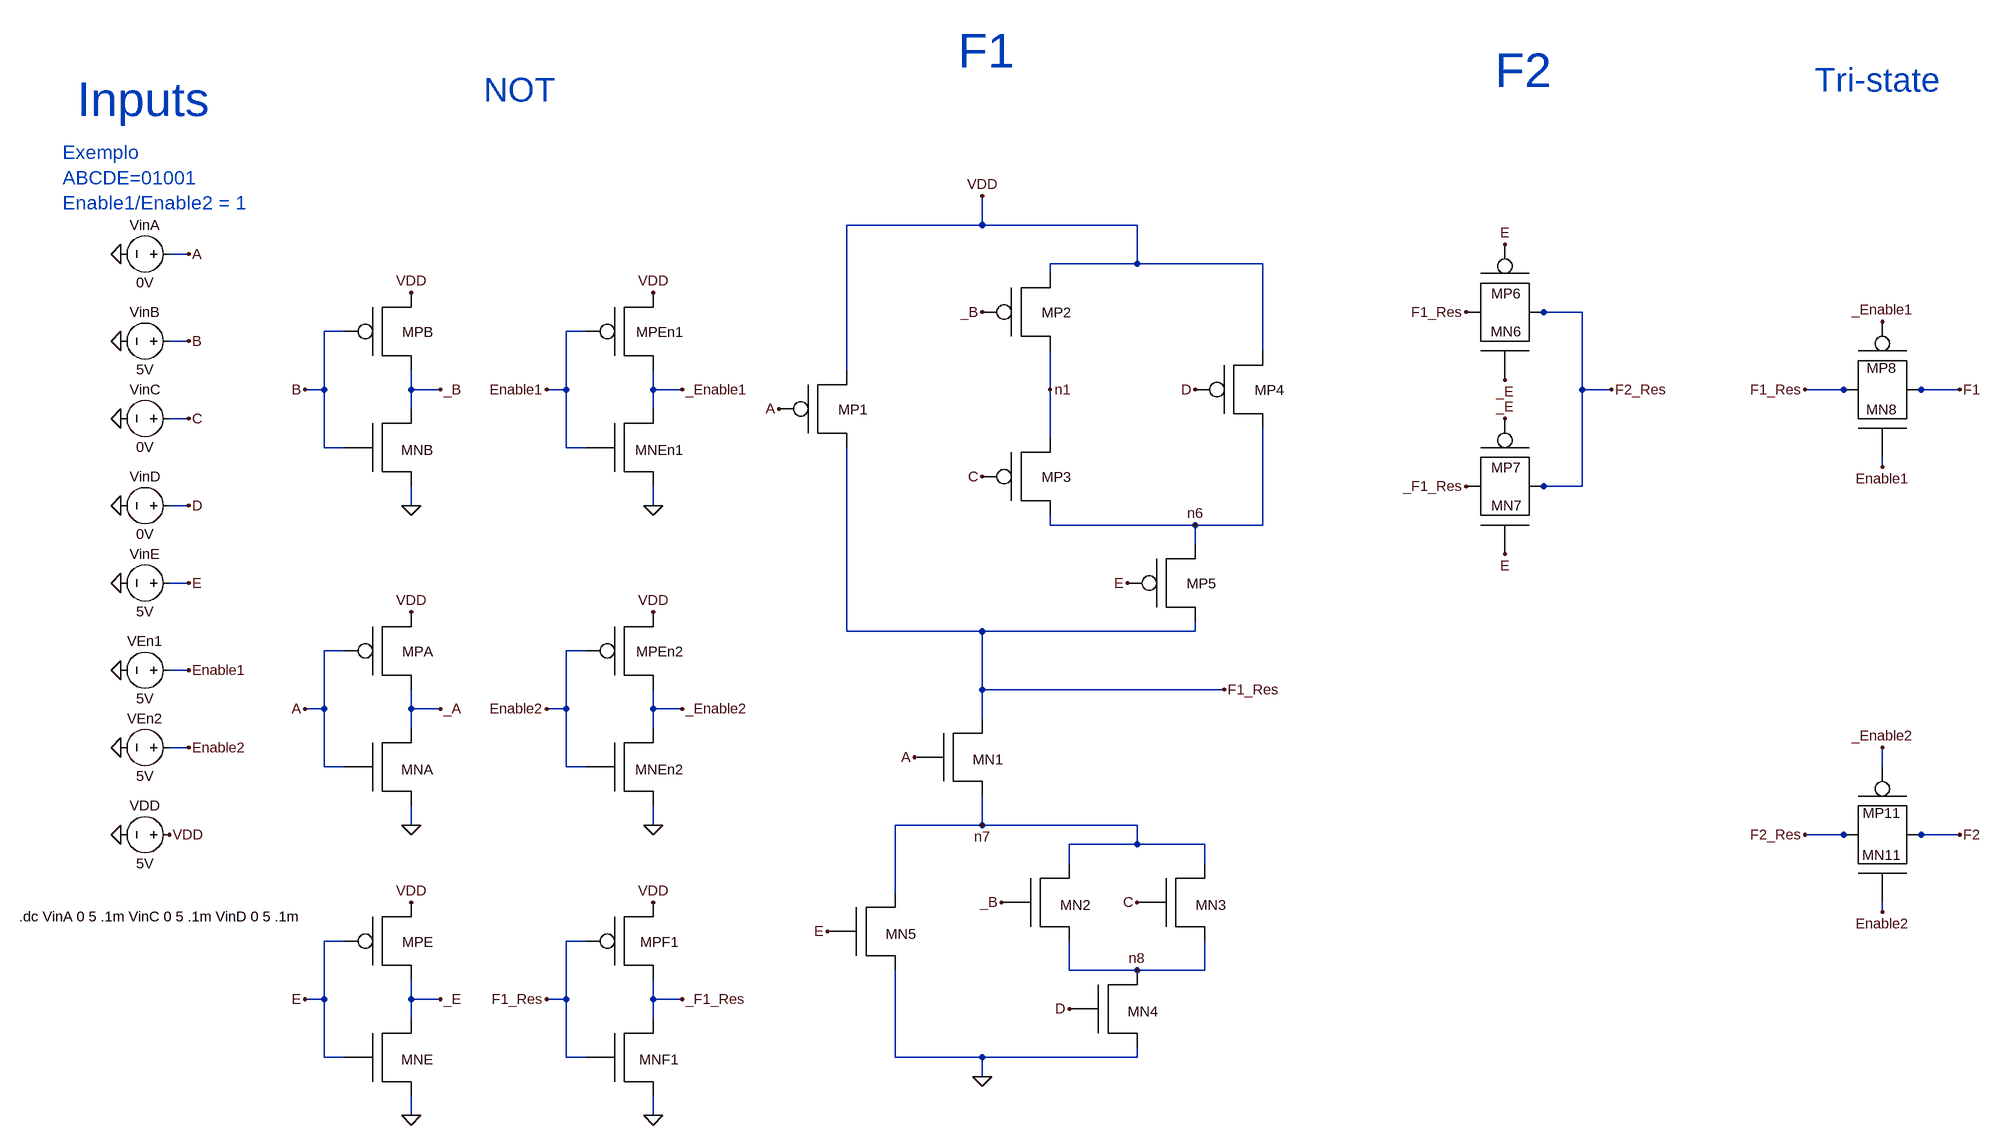
[diagram p0: schematic Tensao_VTC.asc]
Tensao_VTC.asc, the LTspice schematic file:
Version 4
SHEET 1 3140 2108
WIRE -32 -560 -32 -608
WIRE -32 -560 -256 -560
WIRE 224 -560 -32 -560
WIRE -1344 -512 -1376 -512
WIRE 224 -496 224 -560
WIRE 224 -496 80 -496
WIRE 432 -496 224 -496
WIRE 80 -480 80 -496
WIRE 896 -416 880 -416
WIRE 960 -416 896 -416
WIRE -1088 -384 -1120 -384
WIRE -688 -384 -720 -384
WIRE -1344 -368 -1376 -368
WIRE 432 -352 432 -496
WIRE -256 -320 -256 -560
WIRE -1120 -288 -1120 -384
WIRE -1120 -288 -1152 -288
WIRE -976 -288 -976 -320
WIRE -928 -288 -976 -288
WIRE -720 -288 -720 -384
WIRE -720 -288 -752 -288
WIRE -576 -288 -576 -320
WIRE -528 -288 -576 -288
WIRE 80 -288 80 -352
WIRE 960 -288 960 -416
WIRE 1008 -288 960 -288
WIRE 1392 -288 1328 -288
WIRE 1584 -288 1520 -288
WIRE -976 -256 -976 -288
WIRE -576 -256 -576 -288
WIRE -1344 -240 -1376 -240
WIRE 80 -208 80 -288
WIRE -1120 -192 -1120 -288
WIRE -1088 -192 -1120 -192
WIRE -720 -192 -720 -288
WIRE -688 -192 -720 -192
WIRE 1456 -160 1456 -176
WIRE 896 -128 880 -128
WIRE 960 -128 960 -288
WIRE 960 -128 896 -128
WIRE -1344 -96 -1376 -96
WIRE -976 -96 -976 -128
WIRE -576 -96 -576 -128
WIRE 80 -64 80 -80
WIRE 320 -64 80 -64
WIRE 432 -64 432 -224
WIRE 432 -64 320 -64
WIRE 320 -32 320 -64
WIRE -1344 32 -1376 32
WIRE -256 112 -256 -192
WIRE -32 112 -256 112
WIRE 320 112 320 96
WIRE 320 112 -32 112
WIRE -1088 144 -1120 144
WIRE -688 144 -720 144
WIRE -1344 176 -1376 176
WIRE -32 208 -32 112
WIRE 368 208 -32 208
WIRE -1120 240 -1120 144
WIRE -1120 240 -1152 240
WIRE -976 240 -976 208
WIRE -928 240 -976 240
WIRE -720 240 -720 144
WIRE -720 240 -752 240
WIRE -576 240 -576 208
WIRE -528 240 -576 240
WIRE -32 256 -32 208
WIRE -976 272 -976 240
WIRE -576 272 -576 240
WIRE -1344 304 -1376 304
WIRE -1120 336 -1120 240
WIRE -1088 336 -1120 336
WIRE -720 336 -720 240
WIRE -688 336 -720 336
WIRE 1456 336 1456 304
WIRE -976 432 -976 400
WIRE -576 432 -576 400
WIRE -32 432 -32 384
WIRE -32 432 -176 432
WIRE 224 432 -32 432
WIRE 1392 448 1328 448
WIRE 1584 448 1520 448
WIRE 224 464 224 432
WIRE 224 464 112 464
WIRE 336 464 224 464
WIRE 112 496 112 464
WIRE 336 496 336 464
WIRE -176 544 -176 432
WIRE 1456 576 1456 560
WIRE -1088 624 -1120 624
WIRE -688 624 -720 624
WIRE 112 672 112 624
WIRE 224 672 112 672
WIRE 336 672 336 624
WIRE 336 672 224 672
WIRE -1120 720 -1120 624
WIRE -1120 720 -1152 720
WIRE -976 720 -976 688
WIRE -928 720 -976 720
WIRE -720 720 -720 624
WIRE -720 720 -752 720
WIRE -576 720 -576 688
WIRE -528 720 -576 720
WIRE -976 752 -976 720
WIRE -576 752 -576 720
WIRE -1120 816 -1120 720
WIRE -1088 816 -1120 816
WIRE -720 816 -720 720
WIRE -688 816 -720 816
WIRE -176 816 -176 672
WIRE -32 816 -176 816
WIRE 224 816 224 800
WIRE 224 816 -32 816
WIRE -32 848 -32 816
WIRE -976 912 -976 880
WIRE -576 912 -576 880
FLAG -368 -256 A
FLAG -32 -144 C
FLAG 320 -288 D
FLAG 208 32 E
FLAG -144 320 A
FLAG -288 608 E
FLAG 224 560 C
FLAG 112 736 D
FLAG -32 848 0
FLAG 368 208 F1_Res
FLAG -32 -608 VDD
FLAG -32 -416 _B
FLAG 0 560 _B
FLAG -1152 -288 B
FLAG -928 -288 _B
FLAG -976 -96 0
FLAG -928 240 _A
FLAG -976 432 0
FLAG -1456 448 0
FLAG -1376 448 VDD
FLAG -976 -448 VDD
FLAG -976 80 VDD
FLAG -1344 -512 A
FLAG 1328 -288 F1_Res
FLAG 1584 -288 F1
FLAG 1456 576 Enable2
FLAG 1328 448 F2_Res
FLAG 1584 448 F2
FLAG 1456 304 _Enable2
FLAG -752 -288 Enable1
FLAG -528 -288 _Enable1
FLAG -576 -96 0
FLAG -752 240 Enable2
FLAG -528 240 _Enable2
FLAG -576 432 0
FLAG -576 -448 VDD
FLAG -576 80 VDD
FLAG 1456 -160 Enable1
FLAG 1456 -400 _Enable1
FLAG 80 -288 n1
FLAG -1456 -512 0
FLAG -1344 -368 B
FLAG -1456 -368 0
FLAG -1344 -240 C
FLAG -1456 -240 0
FLAG -1344 -96 D
FLAG -1456 -96 0
FLAG -1344 32 E
FLAG -1456 32 0
FLAG -1344 176 Enable1
FLAG -1456 176 0
FLAG -1344 304 Enable2
FLAG -1456 304 0
FLAG -1152 240 A
FLAG 320 -64 n6
FLAG -32 432 n7
FLAG 224 672 n8
FLAG 1008 -288 F2_Res
FLAG 768 -416 F1_Res
FLAG 768 -128 _F1_Res
FLAG 832 -528 E
FLAG 832 -304 _E
FLAG 832 -240 _E
FLAG 832 -16 E
FLAG -1152 720 E
FLAG -928 720 _E
FLAG -976 912 0
FLAG -976 560 VDD
FLAG -752 720 F1_Res
FLAG -528 720 _F1_Res
FLAG -576 912 0
FLAG -576 560 VDD
SYMBOL PMOSX -288 -272 R0
SYMATTR InstName MP1
SYMBOL PMOSX 48 -432 R0
SYMATTR InstName MP2
SYMBOL PMOSX 48 -160 R0
SYMATTR InstName MP3
SYMBOL PMOSX 400 -304 R0
SYMATTR InstName MP4
SYMBOL PMOSX 288 16 R0
SYMATTR InstName MP5
SYMBOL NMOSX -64 304 R0
SYMATTR InstName MN1
SYMBOL NMOSX 80 544 R0
SYMATTR InstName MN2
SYMBOL NMOSX 304 544 R0
SYMATTR InstName MN3
SYMBOL NMOSX 192 720 R0
SYMATTR InstName MN4
SYMBOL NMOSX -208 592 R0
SYMATTR InstName MN5
SYMBOL NMOSX -1008 -208 R0
SYMATTR InstName MNB
SYMBOL PMOSX -1008 -400 R0
SYMATTR InstName MPB
SYMBOL NMOSX -1008 320 R0
SYMATTR InstName MNA
SYMBOL PMOSX -1008 128 R0
SYMATTR InstName MPA
SYMBOL voltage -1360 448 R90
WINDOW 0 -32 56 VBottom 2
WINDOW 3 32 56 VTop 2
WINDOW 123 0 0 Left 0
WINDOW 39 0 0 Left 0
SYMATTR InstName VDD
SYMATTR Value 5V
SYMBOL NMOSX 1440 -256 R270
WINDOW 0 52 15 VTop 2
SYMATTR InstName MP8
SYMBOL PMOSX 1472 -320 R90
WINDOW 0 50 17 VTop 2
SYMATTR InstName MN8
SYMBOL NMOSX 1440 480 R270
WINDOW 0 52 15 VTop 2
SYMATTR InstName MP11
SYMBOL PMOSX 1472 416 R90
WINDOW 0 50 17 VTop 2
SYMATTR InstName MN11
SYMBOL NMOSX -608 -208 R0
SYMATTR InstName MNEn1
SYMBOL PMOSX -608 -400 R0
SYMATTR InstName MPEn1
SYMBOL NMOSX -608 320 R0
SYMATTR InstName MNEn2
SYMBOL PMOSX -608 128 R0
SYMATTR InstName MPEn2
SYMBOL voltage -1360 -512 R90
WINDOW 0 -32 56 VBottom 2
WINDOW 3 32 56 VTop 2
WINDOW 123 0 0 Left 0
WINDOW 39 0 0 Left 0
SYMATTR InstName VinA
SYMATTR Value 0V
SYMBOL voltage -1360 -368 R90
WINDOW 0 -32 56 VBottom 2
WINDOW 3 32 56 VTop 2
WINDOW 123 0 0 Left 0
WINDOW 39 0 0 Left 0
SYMATTR InstName VinB
SYMATTR Value 5V
SYMBOL voltage -1360 -240 R90
WINDOW 0 -32 56 VBottom 2
WINDOW 3 32 56 VTop 2
WINDOW 123 0 0 Left 0
WINDOW 39 0 0 Left 0
SYMATTR InstName VinC
SYMATTR Value 0V
SYMBOL voltage -1360 -96 R90
WINDOW 0 -32 56 VBottom 2
WINDOW 3 32 56 VTop 2
WINDOW 123 0 0 Left 0
WINDOW 39 0 0 Left 0
SYMATTR InstName VinD
SYMATTR Value 0V
SYMBOL voltage -1360 32 R90
WINDOW 0 -32 56 VBottom 2
WINDOW 3 32 56 VTop 2
WINDOW 123 0 0 Left 0
WINDOW 39 0 0 Left 0
SYMATTR InstName VinE
SYMATTR Value 5V
SYMBOL voltage -1360 176 R90
WINDOW 0 -32 56 VBottom 2
WINDOW 3 32 56 VTop 2
WINDOW 123 0 0 Left 0
WINDOW 39 0 0 Left 0
SYMATTR InstName VEn1
SYMATTR Value 5V
SYMBOL voltage -1360 304 R90
WINDOW 0 -32 56 VBottom 2
WINDOW 3 32 56 VTop 2
WINDOW 123 0 0 Left 0
WINDOW 39 0 0 Left 0
SYMATTR InstName VEn2
SYMATTR Value 5V
SYMBOL NMOSX 816 -384 R270
WINDOW 0 -16 18 VTop 2
SYMATTR InstName MN6
SYMBOL NMOSX 816 -96 R270
WINDOW 0 -16 19 VTop 2
SYMATTR InstName MN7
SYMBOL PMOSX 848 -448 R90
WINDOW 0 -14 14 VTop 2
SYMATTR InstName MP6
SYMBOL PMOSX 848 -160 R90
WINDOW 0 -14 14 VTop 2
SYMATTR InstName MP7
SYMBOL NMOSX -1008 800 R0
SYMATTR InstName MNE
SYMBOL PMOSX -1008 608 R0
SYMATTR InstName MPE
SYMBOL NMOSX -608 800 R0
SYMATTR InstName MNF1
SYMBOL PMOSX -608 608 R0
SYMATTR InstName MPF1
TEXT -72 -848 Left 6 ;F1
TEXT 816 -816 Left 6 ;F2
TEXT -856 -784 Left 5 ;NOT
TEXT -1528 -768 Left 6 ;Inputs
TEXT -1552 -680 Left 3 ;Exemplo \nABCDE=01001\nEnable1/Enable2 = 1
TEXT -1624 584 Left 2 !.dc VinA 0 5 .1m VinC 0 5 .1m VinD 0 5 .1m
TEXT 1344 -800 Left 5 ;Tri-state

The netlist it stands for:
* Tensao_VTC.asc
XMP1 F1_Res A VDD PMOSX  ; pins D G S
XMP2 n1 _B VDD PMOSX  ; pins D G S
XMP3 n6 C n1 PMOSX  ; pins D G S
XMP4 n6 D VDD PMOSX  ; pins D G S
XMP5 F1_Res E n6 PMOSX  ; pins D G S
XMN1 F1_Res A n7 NMOSX  ; pins D G S
XMN2 n7 _B n8 NMOSX  ; pins D G S
XMN3 n7 C n8 NMOSX  ; pins D G S
XMN4 n8 D 0 NMOSX  ; pins D G S
XMN5 n7 E 0 NMOSX  ; pins D G S
XMNB _B B 0 NMOSX  ; pins D G S
XMPB _B B VDD PMOSX  ; pins D G S
XMNA _A A 0 NMOSX  ; pins D G S
XMPA _A A VDD PMOSX  ; pins D G S
VDD VDD 0 5V
XMP8 F1_Res Enable1 F1 NMOSX  ; pins D G S
XMN8 F1_Res _Enable1 F1 PMOSX  ; pins D G S
XMP11 F2_Res Enable2 F2 NMOSX  ; pins D G S
XMN11 F2_Res _Enable2 F2 PMOSX  ; pins D G S
XMNEn1 _Enable1 Enable1 0 NMOSX  ; pins D G S
XMPEn1 _Enable1 Enable1 VDD PMOSX  ; pins D G S
XMNEn2 _Enable2 Enable2 0 NMOSX  ; pins D G S
XMPEn2 _Enable2 Enable2 VDD PMOSX  ; pins D G S
VinA A 0 0V
VinB B 0 5V
VinC C 0 0V
VinD D 0 0V
VinE E 0 5V
VEn1 Enable1 0 5V
VEn2 Enable2 0 5V
XMN6 F1_Res _E F2_Res NMOSX  ; pins D G S
XMN7 _F1_Res E F2_Res NMOSX  ; pins D G S
XMP6 F1_Res E F2_Res PMOSX  ; pins D G S
XMP7 _F1_Res _E F2_Res PMOSX  ; pins D G S
XMNE _E E 0 NMOSX  ; pins D G S
XMPE _E E VDD PMOSX  ; pins D G S
XMNF1 _F1_Res F1_Res 0 NMOSX  ; pins D G S
XMPF1 _F1_Res F1_Res VDD PMOSX  ; pins D G S
* F1
* F2
* NOT
* Inputs
* Exemplo
* ABCDE=01001
* Enable1/Enable2 = 1
.dc VinA 0 5 .1m VinC 0 5 .1m VinD 0 5 .1m
* Tri-state
.backanno
.end